# Altium schematic sheet projet.SchDoc
size A4
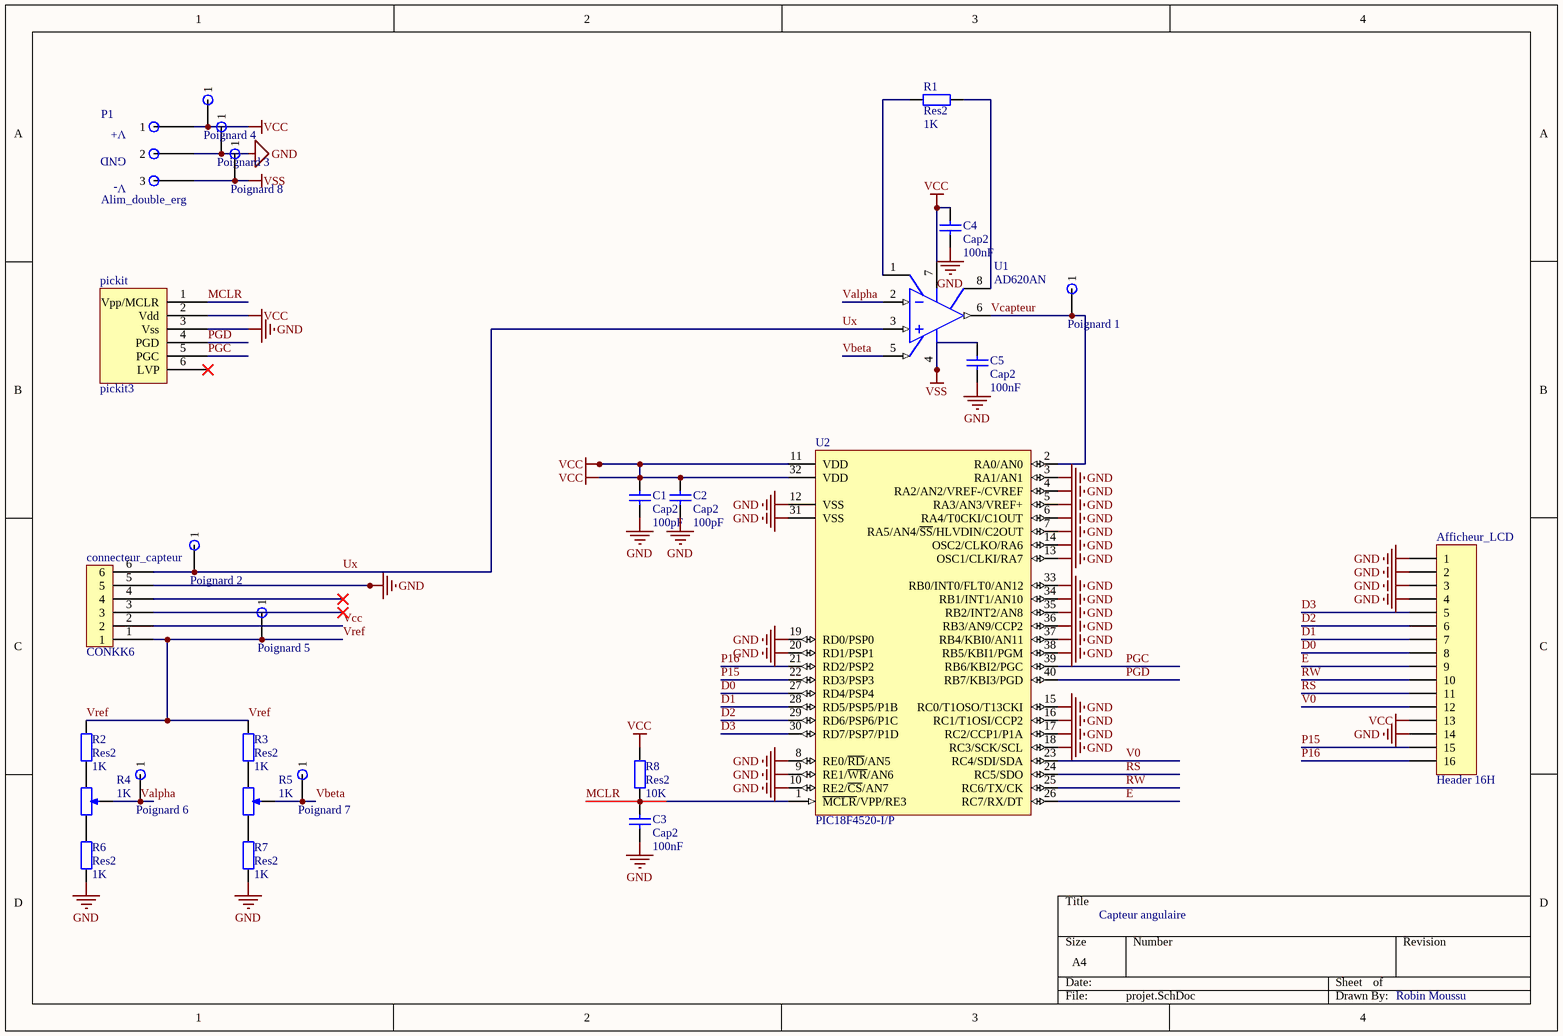
[diagram p0: projet.SchDoc]

## Parts
Afficheur_LCD  Header 16H  [HDR1X16H]
C1  Cap2  value 100pF  [CAPA2]
C2  Cap2  value 100pF  [CAPA2]
C3  Cap2  value 100nF  [CAPA2]
C4  Cap2  value 100nF  [CAPA2]
C5  Cap2  value 100nF  [CAPA2]
connecteur_capteur  CONKK6  [CONKK6]
P1  Alim_double_erg  [Alim_double_erg]
pickit  pickit3  [pickit3]
Poignard_1  Poignard  [Poignard]  (value not drawn)
Poignard_2  Poignard  [Poignard]  (value not drawn)
Poignard_3  Poignard  [Poignard]  (value not drawn)
Poignard_4  Poignard  [Poignard]  (value not drawn)
Poignard_5  Poignard  [Poignard]  (value not drawn)
Poignard_6  Poignard  [Poignard]  (value not drawn)
Poignard_7  Poignard  [Poignard]  (value not drawn)
Poignard_8  Poignard  [Poignard]  (value not drawn)
R1  Res2  value 1K  [res5_1/4W]
R2  Res2  value 1K  [res5_1/4W]
R3  Res2  value 1K  [res5_1/4W]
R4  value 1K  [AJUSTABLE]  (hidden comment: RPot1)
R5  value 1K  [AJUSTABLE]  (hidden comment: RPot1)
R6  Res2  value 1K  [res5_1/4W]
R7  Res2  value 1K  [res5_1/4W]
R8  Res2  value 10K  [res5_1/4W]
U1  AD620AN  [DIP8]
U2  PIC18F4520-I/P  [PDIP600-P40]

## Nets
GND: Afficheur_LCD.1 Afficheur_LCD.2 Afficheur_LCD.3 Afficheur_LCD.4 Afficheur_LCD.14 C1.1 C2.1 C3.1 C4.1 C5.1 connecteur_capteur.5 P1.2 pickit.3(Vss) Poignard_3.1 R6.1 R7.1 U2.3(RA1/AN1) U2.4(RA2/AN2/VREF-/CVREF) U2.5(RA3/AN3/VREF+) U2.6(RA4/T0CKI/C1OUT) U2.7(RA5/AN4/~{SS}/HLVDIN/C2OUT) U2.8(RE0/~{RD}/AN5) U2.9(RE1/~{WR}/AN6) U2.10(RE2/~{CS}/AN7) U2.12(VSS) U2.13(OSC1/CLKI/RA7) U2.14(OSC2/CLKO/RA6) U2.15(RC0/T1OSO/T13CKI) U2.16(RC1/T1OSI/CCP2) U2.17(RC2/CCP1/P1A) U2.18(RC3/SCK/SCL) U2.19(RD0/PSP0) U2.20(RD1/PSP1) U2.31(VSS) U2.33(RB0/INT0/FLT0/AN12) U2.34(RB1/INT1/AN10) U2.35(RB2/INT2/AN8) U2.36(RB3/AN9/CCP2) U2.37(RB4/KBI0/AN11) U2.38(RB5/KBI1/PGM)
Vcc: Afficheur_LCD.13 C1.2 C2.2 C4.2 connecteur_capteur.2 P1.1 pickit.2(Vdd) Poignard_4.1 R8.2 U1.7(V+) U2.11(VDD) U2.32(VDD)
VSS: C5.2 P1.3 Poignard_8.1 U1.4(V-)
D0: Afficheur_LCD.8 U2.27(RD4/PSP4)
D1: Afficheur_LCD.7 U2.28(RD5/PSP5/P1B)
D2: Afficheur_LCD.6 U2.29(RD6/PSP6/P1C)
D3: Afficheur_LCD.5 U2.30(RD7/PSP7/P1D)
E: Afficheur_LCD.9 U2.26(RC7/RX/DT)
MCLR: C3.2 pickit.1(Vpp/MCLR) R8.1 U2.1(~{MCLR}/VPP/RE3)
P15: Afficheur_LCD.15 U2.22(RD3/PSP3)
P16: Afficheur_LCD.16 U2.21(RD2/PSP2)
PGC: pickit.5(PGC) U2.39(RB6/KBI2/PGC)
PGD: pickit.4(PGD) U2.40(RB7/KBI3/PGD)
RS: Afficheur_LCD.11 U2.24(RC5/SDO)
RW: Afficheur_LCD.10 U2.25(RC6/TX/CK)
Ux: connecteur_capteur.6 Poignard_2.1 U1.3(+IN)
V0: Afficheur_LCD.12 U2.23(RC4/SDI/SDA)
Valpha: Poignard_6.1 R4.3 U1.2(-IN)
Vbeta: Poignard_7.1 R5.3 U1.5(REF)
Vcapteur: Poignard_1.1 U1.6(OUT) U2.2(RA0/AN0)
Vref: connecteur_capteur.1 Poignard_5.1 R2.2 R3.2
NetR1_1: R1.1 U1.1(RG)
NetR1_2: R1.2 U1.8(RG)
NetR2_1: R2.1 R4.2
NetR3_1: R3.1 R5.2
NetR4_1: R4.1 R6.2
NetR5_1: R5.1 R7.2

Not connected (* = marked no-connect by the designer): connecteur_capteur 3* 4*; pickit 6(LVP)*

## Notes on the sheet
- Capteur angulaire
- Robin Moussu
- (in symbol Alim_double_erg) V+; GND; V-

## Library data of the parts
Afficheur_LCD = Header 16H: Header, 16-Pin, Right Angle; LatestRevisionDate: 17-Jul-2002; LatestRevisionNote: Re-released for DXP Platform.; Publisher: Altium Limited
C1-C5 = Cap2: Capacitor; Published: 8-Jun-2000; LatestRevisionDate: 17-Jul-2002; LatestRevisionNote: Re-released for DXP Platform.; PackageReference: RAD-0.3; Publisher: Altium Limited
P1 = Alim_double_erg: 3-Pin; LatestRevisionDate: 17-Jul-2002; LatestRevisionNote: Re-released for DXP Platform.; Publisher: Altium Limited
R1-R3 R6-R8 = Res2: Resistor; Published: 8-Jun-2000; LatestRevisionDate: 17-Jul-2002; LatestRevisionNote: Re-released for DXP Platform.; PackageReference: AXIAL-0.4; Publisher: Altium Limited
R4 R5 = RPot1: Potentiometer; Sim Note: Enter the Resistance value and the set point into parameter fields.; Set Position: 0.5; Published: 8-Jun-2000; LatestRevisionDate: 17-Jul-2002; LatestRevisionNote: Re-released for DXP Platform.; PackageReference: VR5; Publisher: Altium Limited
U1 = AD620AN: Low-Cost, Low-Power Instrumentation Amplifier; Published: 8-Jun-2000; LatestRevisionDate: 04-Mar-2005; LatestRevisionNote: Stylized 3D Model Added.; DatasheetVersion: REV.D 1998; PackageVersion: revA; PackageReference: N-8; Publisher: Altium Limited; PackageDescription: DIP; 8 Leads; Row Spacing 7.62 mm; Pitch 2.54 mm; ComponentLink1Description: Manufacturer Link; ComponentLink1URL: http://www.analog.com/en/prod/0%2C2877%2CAD620%2C00.html; ComponentLink2Description: Datasheet; ComponentLink2URL: http://www.analog.com/UploadedFiles/Data_Sheets/897653854AD620_g.pdf
U2 = PIC18F4520-I/P: Enhanced Flash Microcontroller with 10-Bit A/D and nanoWatt Technology, 32K Flash, 40-Pin PDIP, Industrial Temperature Range; Published: 29-Jan-2009; LatestRevisionDate: 02-Dec-2009; LatestRevisionNote: Updated to datasheet revision E, Oct-2008; DatasheetVersion: revE, Oct-2008; PackageVersion: revBB, Aug-2009; PackageReference: PDIP600-P40; Publisher: Altium Limited; PackageDescription: 40-Lead Plastic Dual In-Line (P) - 600 mil Body [PDIP]; Supplier 1: Digi-Key; Supplier Part Number 1: PIC18F4520-I/P-ND; Supplier 2: Farnell; Supplier Part Number 2: 1523812; Supplier 3: Farnell; Supplier Part Number 3: 1212702; ComponentLink1Description: Datasheet; ComponentLink1URL: http://ww1.microchip.com/downloads/en/DeviceDoc/39631E.pdf; ComponentLink2Description: Packaging Specification; ComponentLink2URL: http://www.microchip.com/stellent/groups/techpub_sg/documents/packagingspec/en012702.pdf; ComponentLink3Description: Microchip.com Home; ComponentLink3URL: http://www.microchip.com/
Poignard_1-Poignard_8 = Poignard: LatestRevisionDate: 17-Jul-2002; LatestRevisionNote: Re-released for DXP Platform.; Publisher: Altium Limited